# EAGLE design Cherry-MX-Testboard (EAGLE 9.3.2)
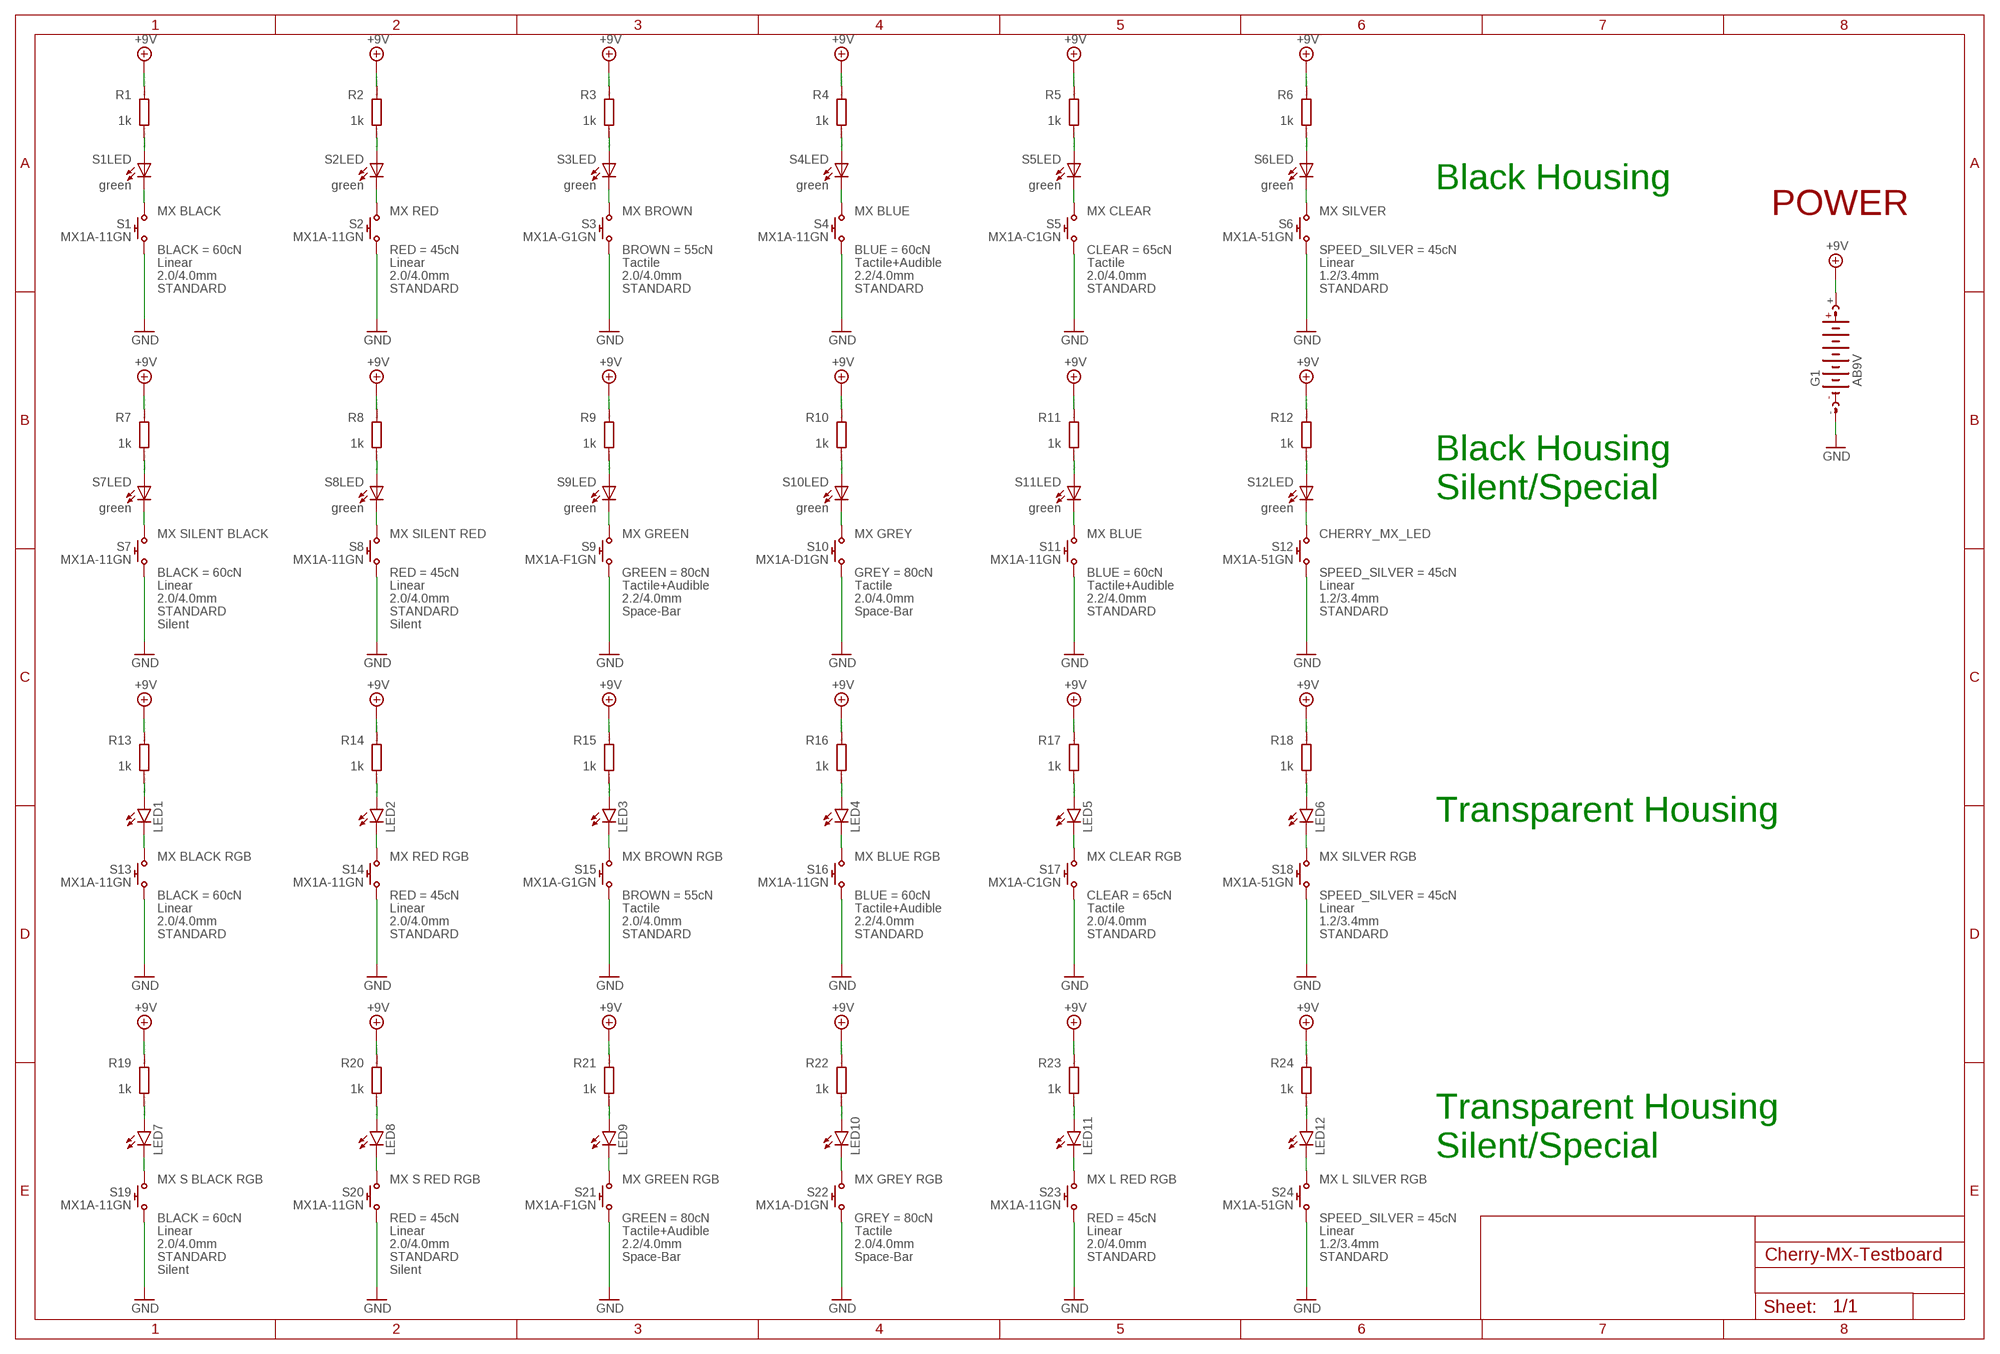
[diagram p0: schematic, sheet 1]

## Parts
G1  AB9V  [AB9V]
LED1  LEDMINI-TOP  [OSRAM-MINI-TOP-LED]
LED2  LEDMINI-TOP  [OSRAM-MINI-TOP-LED]
LED3  LEDMINI-TOP  [OSRAM-MINI-TOP-LED]
LED4  LEDMINI-TOP  [OSRAM-MINI-TOP-LED]
LED5  LEDMINI-TOP  [OSRAM-MINI-TOP-LED]
LED6  LEDMINI-TOP  [OSRAM-MINI-TOP-LED]
LED7  LEDMINI-TOP  [OSRAM-MINI-TOP-LED]
LED8  LEDMINI-TOP  [OSRAM-MINI-TOP-LED]
LED9  LEDMINI-TOP  [OSRAM-MINI-TOP-LED]
LED10  LEDMINI-TOP  [OSRAM-MINI-TOP-LED]
LED11  LEDMINI-TOP  [OSRAM-MINI-TOP-LED]
LED12  LEDMINI-TOP  [OSRAM-MINI-TOP-LED]
R1  1k  RR0402  [R0402]
R2  1k  RR0402  [R0402]
R3  1k  RR0402  [R0402]
R4  1k  RR0402  [R0402]
R5  1k  RR0402  [R0402]
R6  1k  RR0402  [R0402]
R7  1k  RR0402  [R0402]
R8  1k  RR0402  [R0402]
R9  1k  RR0402  [R0402]
R10  1k  RR0402  [R0402]
R11  1k  RR0402  [R0402]
R12  1k  RR0402  [R0402]
R13  1k  RR0402  [R0402]
R14  1k  RR0402  [R0402]
R15  1k  RR0402  [R0402]
R16  1k  RR0402  [R0402]
R17  1k  RR0402  [R0402]
R18  1k  RR0402  [R0402]
R19  1k  RR0402  [R0402]
R20  1k  RR0402  [R0402]
R21  1k  RR0402  [R0402]
R22  1k  RR0402  [R0402]
R23  1k  RR0402  [R0402]
R24  1k  RR0402  [R0402]
S1  MX BLACK  CHERRY_MX_LED  [CHERRY_MX_LED]
S2  MX RED  CHERRY_MX_LED  [CHERRY_MX_LED]
S3  MX BROWN  CHERRY_MX_LED  [CHERRY_MX_LED]
S4  MX BLUE  CHERRY_MX_LED  [CHERRY_MX_LED]
S5  MX CLEAR  CHERRY_MX_LED  [CHERRY_MX_LED]
S6  MX SILVER  CHERRY_MX_LED  [CHERRY_MX_LED]
S7  MX SILENT BLACK  CHERRY_MX_LED  [CHERRY_MX_LED]
S8  MX SILENT RED  CHERRY_MX_LED  [CHERRY_MX_LED]
S9  MX GREEN  CHERRY_MX_LED  [CHERRY_MX_LED]
S10  MX GREY  CHERRY_MX_LED  [CHERRY_MX_LED]
S11  MX BLUE  CHERRY_MX_LED  [CHERRY_MX_LED]
S12  CHERRY_MX_LED  [CHERRY_MX_LED]
S13  MX BLACK RGB  CHERRY_MX  [CHERRY_MX]
S14  MX RED RGB  CHERRY_MX  [CHERRY_MX]
S15  MX BROWN RGB  CHERRY_MX  [CHERRY_MX]
S16  MX BLUE RGB  CHERRY_MX  [CHERRY_MX]
S17  MX CLEAR RGB  CHERRY_MX  [CHERRY_MX]
S18  MX SILVER RGB  CHERRY_MX  [CHERRY_MX]
S19  MX S BLACK RGB  CHERRY_MX  [CHERRY_MX]
S20  MX S RED RGB  CHERRY_MX  [CHERRY_MX]
S21  MX GREEN RGB  CHERRY_MX  [CHERRY_MX]
S22  MX GREY RGB  CHERRY_MX  [CHERRY_MX]
S23  MX L RED RGB  CHERRY_MX  [CHERRY_MX]
S24  MX L SILVER RGB  CHERRY_MX  [CHERRY_MX]

## Nets
+9V [+9V]: G1.+ R1.1 R2.1 R3.1 R4.1 R5.1 R6.1 R7.1 R8.1 R9.1 R10.1 R11.1 R12.1 R13.1 R14.1 R15.1 R16.1 R17.1 R18.1 R19.1 R20.1 R21.1 R22.1 R23.1 R24.1
GND [GND]: G1.- S1.S1 S2.S1 S3.S1 S4.S1 S5.S1 S6.S1 S7.S1 S8.S1 S9.S1 S10.S1 S11.S1 S12.S1 S13.S1 S14.S1 S15.S1 S16.S1 S17.S1 S18.S1 S19.S1 S20.S1 S21.S1 S22.S1 S23.S1 S24.S1
N$1: S1.L2(C) S1.S2
N$2: S2.L2(C) S2.S2
N$3: R1.2 S1.L1(A)
N$4: R2.2 S2.L1(A)
N$5: S3.L2(C) S3.S2
N$6: R3.2 S3.L1(A)
N$7: S4.L2(C) S4.S2
N$8: R4.2 S4.L1(A)
N$9: S9.L2(C) S9.S2
N$10: R9.2 S9.L1(A)
N$11: S10.L2(C) S10.S2
N$12: R10.2 S10.L1(A)
N$13: S5.L2(C) S5.S2
N$14: R5.2 S5.L1(A)
N$15: S6.L2(C) S6.S2
N$16: R6.2 S6.L1(A)
N$17: S7.L2(C) S7.S2
N$18: R7.2 S7.L1(A)
N$19: S8.L2(C) S8.S2
N$20: R8.2 S8.L1(A)
N$21: LED1.C S13.S2
N$22: LED1.A R13.2
N$23: LED2.C S14.S2
N$24: LED2.A R14.2
N$25: LED3.C S15.S2
N$26: LED3.A R15.2
N$27: LED4.C S16.S2
N$28: LED4.A R16.2
N$29: LED9.C S21.S2
N$30: LED9.A R21.2
N$31: LED10.C S22.S2
N$32: LED10.A R22.2
N$33: LED5.C S17.S2
N$34: LED5.A R17.2
N$35: LED6.C S18.S2
N$36: LED6.A R18.2
N$37: LED7.C S19.S2
N$38: LED7.A R19.2
N$39: LED8.C S20.S2
N$40: LED8.A R20.2
N$41: LED11.C S23.S2
N$42: LED11.A R23.2
N$43: LED12.C S24.S2
N$44: LED12.A R24.2
N$45: S11.L2(C) S11.S2
N$46: R11.2 S11.L1(A)
N$47: S12.L2(C) S12.S2
N$48: R12.2 S12.L1(A)

## Notes on the sheet
- Black Housing
- POWER
- Black Housing
  Silent/Special
- Transparent Housing
- Transparent Housing
  Silent/Special

## Library data of the parts
G1 = battery:AB9V: 9-V BATTERY CLIP
LED1-LED12 = led:LED: LED OSRAM: - CHIPLED LG R971, LG N971, LY N971, LG Q971, LY Q971, LO R971, LY R971 LH N974, LH R974 LS Q976, LO Q976, LY Q976 LO Q996 - Hyper CHIPLED LW Q18S LB Q993, LB Q99A, LB R99A - SideLED LS A670, LO A670, LY A670, LG A670, LP A670 LB A673, LV A673, LT A673, LW A673 LH A674 LY A675 LS A676, LA A676, LO A676, LY A676, LW A676 LS A679, LY A679, LG A679 - Hyper Micro SIDELED® LS Y876, LA Y876, LO Y876, LY Y876 LT Y87S - SmartLED LW L88C, LW L88S LB L89C, LB L89S, LG L890 LS L89K, LO L89K, LY L89K LS L896, LA L896, LO L896, LY L896 - TOPLED LS T670, LO T670, LY T670, LG T670, LP T670 LSG T670, LSP T670, LSY T670, LOP T670, LYG T670 LG T671, LOG T671, LSG T671 LB T673, LV T673, LT T673, LW T673 LH T674 LS T676, LA T676, LO T676, LY T676, LB T676, LH T676, LSB T676, LW T676 LB T67C, LV T67C, LT T67C, LS T67K, LO T67K, LY T67K, LW E67C LS E67B, LA E67B, LO E67B, LY E67B, LB E67C, LV E67C, LT E67C LW T67C LS T679, LY T679, LG T679 LS T770, LO T770, LY T770, LG T770, LP T770 LB T773, LV T773, LT T773, LW T773 LH T774 LS E675, LA E675, LY E675, LS T675 LS T776, LA T776, LO T776, LY T776, LB T776 LHGB T686 LT T68C, LB T68C - Hyper Mini TOPLED® LB M676 - Mini TOPLED Santana® LG M470 LS M47K, LO M47K, LY M47K Source: http://www.osram.convergy.de LUXEON: - LUMILED® LXK2-PW12-R00, LXK2-PW12-S00, LXK2-PW14-U00, LXK2-PW14-V00 LXK2-PM12-R00, LXK2-PM12-S00, LXK2-PM14-U00 LXK2-PE12-Q00, LXK2-PE12-R00, LXK2-PE12-S00, LXK2-PE14-T00, LXK2-PE14-U00 LXK2-PB12-K00, LXK2-PB12-L00, LXK2-PB12-M00, LXK2-PB14-N00, LXK2-PB14-P00, LXK2-PB14-Q00 LXK2-PR12-L00, LXK2-PR12-M00, LXK2-PR14-Q00, LXK2-PR14-R00 LXK2-PD12-Q00, LXK2-PD12-R00, LXK2-PD12-S00 LXK2-PH12-R00, LXK2-PH12-S00 LXK2-PL12-P00, LXK2-PL12-Q00, LXK2-PL12-R00 Source: www.luxeon.com KINGBRIGHT: KA-3528ASYC Source: www.kingbright.com
R1-R24 = eagle-ltspice:R: RESISTOR, European symbol; SPICEMODEL: NONE; SPICEPREFIX: R
S1 = cherry:CHERRY_MX_LED: Cherry MX with LED; BLACK: 60cN; CHARACTERISTICS: Linear; CODE: MX1A-11GN; COLOR: green; FARNELL: 2292961; FEATURE: STANDARD; MOUSER: 540_MX1A_11NW; TRAVEL: 2.0/4.0mm
S2 = cherry:CHERRY_MX_LED: Cherry MX with LED; CHARACTERISTICS: Linear; CODE: MX1A-11GN; COLOR: green; FARNELL: 2292961; FEATURE: STANDARD; MOUSER: 540_MX1A_11NW; RED: 45cN; TRAVEL: 2.0/4.0mm
S3 = cherry:CHERRY_MX_LED: Cherry MX with LED; BROWN: 55cN; CHARACTERISTICS: Tactile; CODE: MX1A-G1GN; COLOR: green; FARNELL: 2292961; FEATURE: STANDARD; MOUSER: 540_MX1A_11NW; TRAVEL: 2.0/4.0mm
S4 S11 = cherry:CHERRY_MX_LED: Cherry MX with LED; BLUE: 60cN; CHARACTERISTICS: Tactile+Audible; CODE: MX1A-11GN; COLOR: green; FARNELL: 2292961; FEATURE: STANDARD; MOUSER: 540_MX1A_E1NW; TRAVEL: 2.2/4.0mm
S5 = cherry:CHERRY_MX_LED: Cherry MX with LED; CHARACTERISTICS: Tactile; CLEAR: 65cN; CODE: MX1A-C1GN; COLOR: green; FARNELL: 2292961; FEATURE: STANDARD; MOUSER: 540_MX1A_11NW; TRAVEL: 2.0/4.0mm
S6 S12 = cherry:CHERRY_MX_LED: Cherry MX with LED; CHARACTERISTICS: Linear; CODE: MX1A-51GN; COLOR: green; FARNELL: 2292961; FEATURE: STANDARD; MOUSER: 540_MX1A_11NW; SPEED_SILVER: 45cN; TRAVEL: 1.2/3.4mm
S7 = cherry:CHERRY_MX_LED: Cherry MX with LED; BLACK: 60cN; CHARACTERISTICS: Linear; CODE: MX1A-11GN; COLOR: green; FARNELL: 2292961; FEATURE: STANDARD; MOUSER: 540_MX1A_11NW; NOISE: Silent; TRAVEL: 2.0/4.0mm
S8 = cherry:CHERRY_MX_LED: Cherry MX with LED; CHARACTERISTICS: Linear; CODE: MX1A-11GN; COLOR: green; FARNELL: 2292961; FEATURE: STANDARD; MOUSER: 540_MX1A_11NW; NOISE: Silent; RED: 45cN; TRAVEL: 2.0/4.0mm
S9 = cherry:CHERRY_MX_LED: Cherry MX with LED; CHARACTERISTICS: Tactile+Audible; CODE: MX1A-F1GN; COLOR: green; FARNELL: 2292961; FEATURE: Space-Bar; GREEN: 80cN; MOUSER: 540_MX1A_11NW; TRAVEL: 2.2/4.0mm
S10 = cherry:CHERRY_MX_LED: Cherry MX with LED; CHARACTERISTICS: Tactile; CODE: MX1A-D1GN; COLOR: green; FARNELL: 2292961; FEATURE: Space-Bar; GREY: 80cN; MOUSER: 540_MX1A_21NW; TRAVEL: 2.0/4.0mm
S13 = cherry:CHERRY_MX: Cherry keymodule MX; BLACK: 60cN; CHARACTERISTICS: Linear; CODE: MX1A-11GN; COLOR: green; FARNELL: 2292961; FEATURE: STANDARD; MOUSER: 540-MX1A-11NW; TRAVEL: 2.0/4.0mm
S14 S23 = cherry:CHERRY_MX: Cherry keymodule MX; CHARACTERISTICS: Linear; CODE: MX1A-11GN; COLOR: green; FARNELL: 2292961; FEATURE: STANDARD; MOUSER: 540-MX1A-11NW; RED: 45cN; TRAVEL: 2.0/4.0mm
S15 = cherry:CHERRY_MX: Cherry keymodule MX; BROWN: 55cN; CHARACTERISTICS: Tactile; CODE: MX1A-G1GN; COLOR: green; FARNELL: 2292961; FEATURE: STANDARD; MOUSER: 540-MX1A-11NW; TRAVEL: 2.0/4.0mm
S16 = cherry:CHERRY_MX: Cherry keymodule MX; BLUE: 60cN; CHARACTERISTICS: Tactile+Audible; CODE: MX1A-11GN; COLOR: green; FARNELL: 2292961; FEATURE: STANDARD; MOUSER: 540-MX1A-11NW; TRAVEL: 2.2/4.0mm
S17 = cherry:CHERRY_MX: Cherry keymodule MX; CHARACTERISTICS: Tactile; CLEAR: 65cN; CODE: MX1A-C1GN; COLOR: green; FARNELL: 2292961; FEATURE: STANDARD; MOUSER: 540-MX1A-11NW; TRAVEL: 2.0/4.0mm
S18 S24 = cherry:CHERRY_MX: Cherry keymodule MX; CHARACTERISTICS: Linear; CODE: MX1A-51GN; COLOR: green; FARNELL: 2292961; FEATURE: STANDARD; MOUSER: 540-MX1A-11NW; SPEED_SILVER: 45cN; TRAVEL: 1.2/3.4mm
S19 = cherry:CHERRY_MX: Cherry keymodule MX; BLACK: 60cN; CHARACTERISTICS: Linear; CODE: MX1A-11GN; COLOR: green; FARNELL: 2292961; FEATURE: STANDARD; MOUSER: 540-MX1A-11NW; NOISE: Silent; TRAVEL: 2.0/4.0mm
S20 = cherry:CHERRY_MX: Cherry keymodule MX; CHARACTERISTICS: Linear; CODE: MX1A-11GN; COLOR: green; FARNELL: 2292961; FEATURE: STANDARD; MOUSER: 540-MX1A-11NW; NOISE: Silent; RED: 45cN; TRAVEL: 2.0/4.0mm
S21 = cherry:CHERRY_MX: Cherry keymodule MX; CHARACTERISTICS: Tactile+Audible; CODE: MX1A-F1GN; COLOR: green; FARNELL: 2292961; FEATURE: Space-Bar; GREEN: 80cN; MOUSER: 540-MX1A-11NW; TRAVEL: 2.2/4.0mm
S22 = cherry:CHERRY_MX: Cherry keymodule MX; CHARACTERISTICS: Tactile; CODE: MX1A-D1GN; COLOR: green; FARNELL: 2292961; FEATURE: Space-Bar; GREY: 80cN; MOUSER: 540-MX1A-11NW; TRAVEL: 2.0/4.0mm

## Net classes
1 GND: width 0.61 mm, drill 0.254 mm, clearance 1.016 mm
2 +9V: width 0.61 mm, drill 0.254 mm, clearance 1.016 mm

## Board
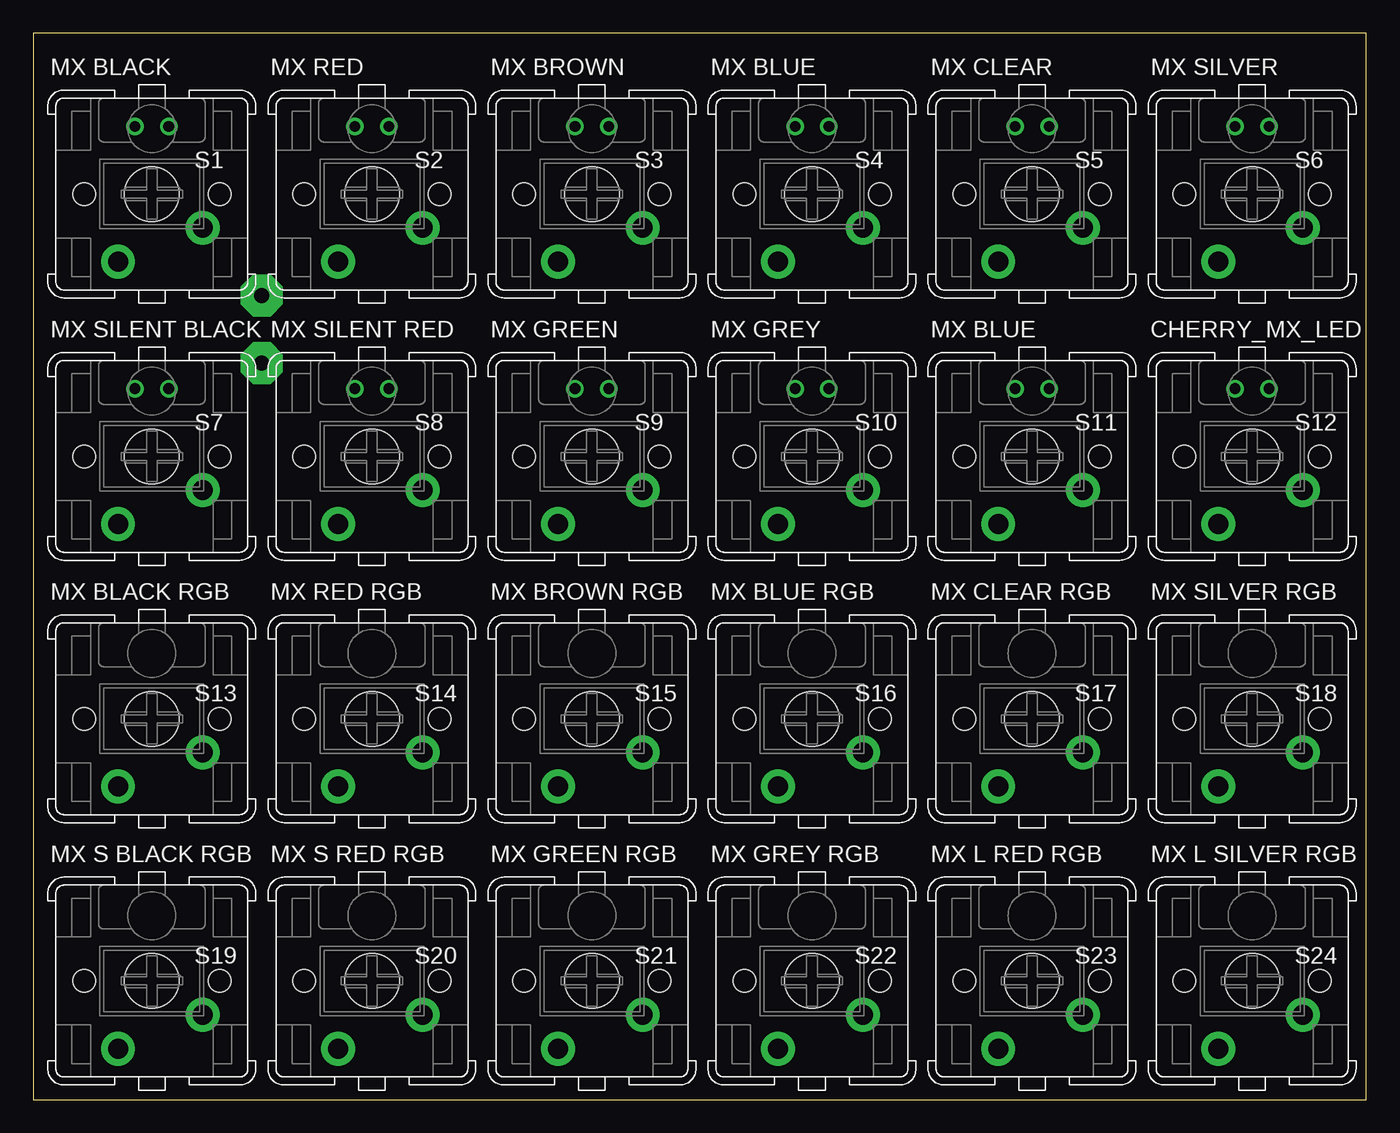
[diagram p1: board, top side]
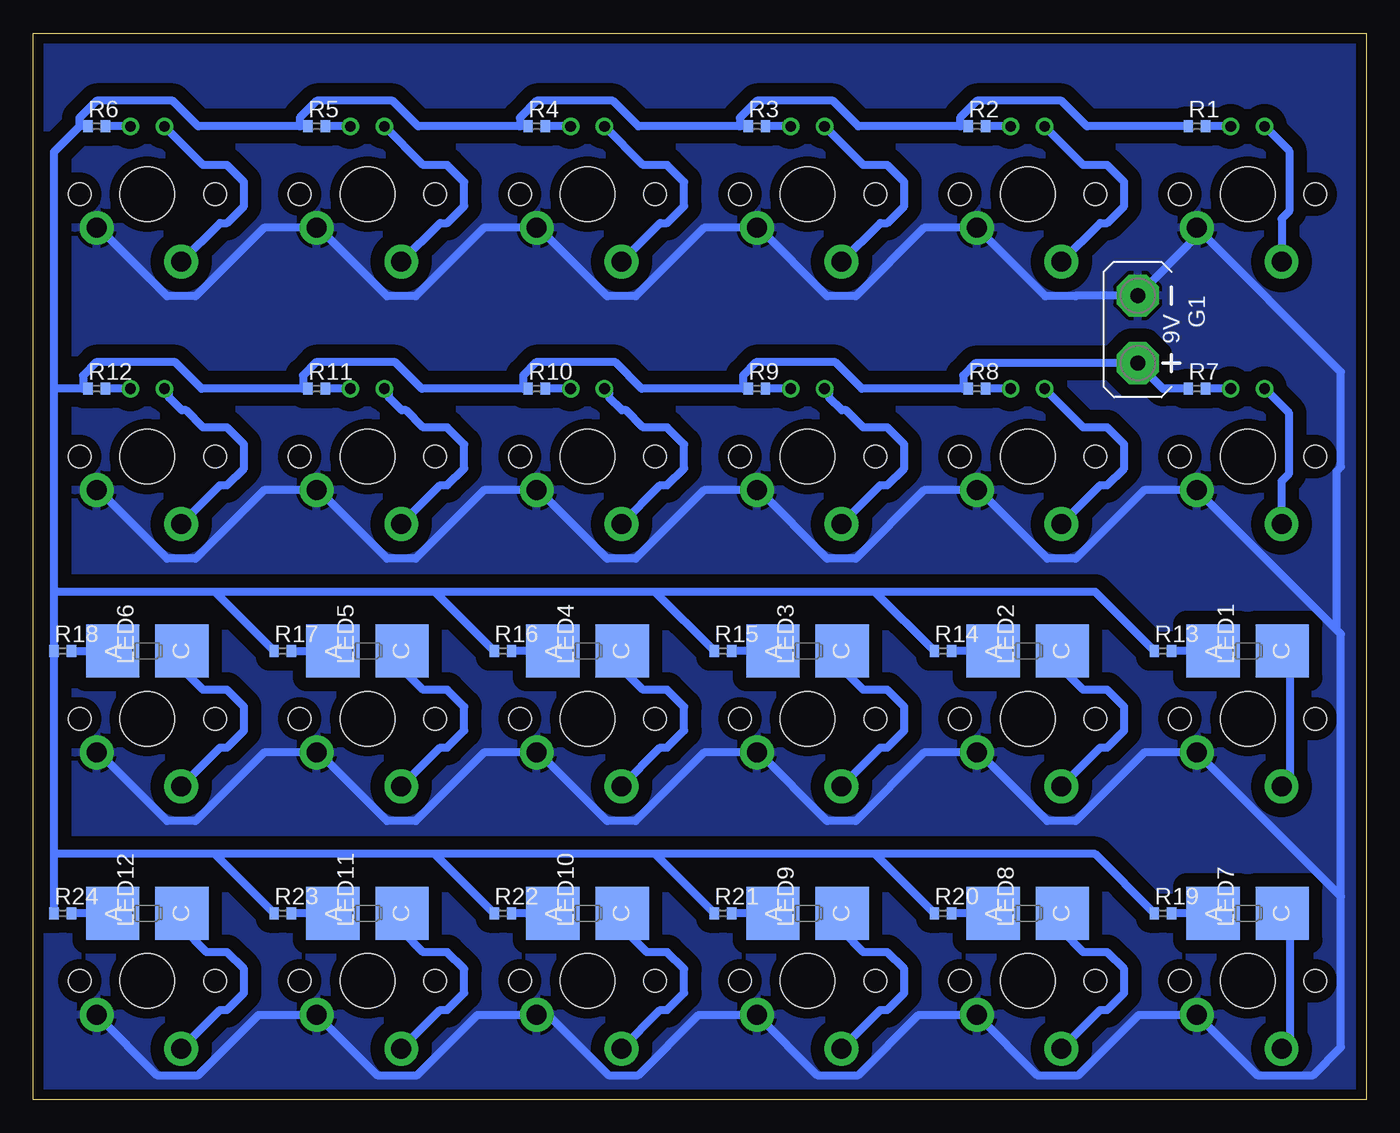
[diagram p2: board, bottom side, seen from below]

Size 100 x 80 mm. Coordinates in mm from the lower left corner, seen from the top.
Outline: 0,0 100,0 100,80 0,80 0,0
Copper layers (1*16): Top 0.035mm / dielectric 1.5mm / Bottom 0.035mm
Design rules "default *": minimum track width 6mil, minimum drill 0.35mm, track to track 10mil, track to pad 10mil, pad to pad 10mil, via to via 10mil, smd to smd 10mil, copper to edge 30mil, drill to drill 6mil, minimum pad ring 10mil, minimum via ring 8mil, stop-mask expansion 4mil, vias tented up to drill 0mil, thermal gap 10mil

### Footprints (pad centres in the part's own frame; a part is rotated, then mirrored left to right if it is on the bottom)
AB9V = drill 1.118 pad 3.15 octagon: + 0,2.54; - 0,-2.54
OSRAM-MINI-TOP-LED = smd 4 x 4: A 0,2.6; C 0,-2.6
R0402 = smd 0.7 x 0.9: 1 -0.65,0; 2 0.65,0
CHERRY_MX_LED = drill 0.8: L1 -1.27,-5.08; L2 1.27,-5.08 | drill 1.5 pad 2.54: S1 -3.81,2.54; S2 2.54,5.08 | hole 1.7: -5.08,0; 5.08,0 | hole 4.1: 0,0
CHERRY_MX = drill 1.5 pad 2.54: S1 -3.81,2.54; S2 2.54,5.08 | hole 1.7: -5.08,0; 5.08,0 | hole 4.1: 0,0

### Placement (x,y rotation side)
G1  17.14,57.78 180 bottom
LED1  8.89,33.66 90 bottom
LED2  25.4,33.66 90 bottom
LED3  41.91,33.66 90 bottom
LED4  58.42,33.66 90 bottom
LED5  74.93,33.66 90 bottom
LED6  91.44,33.66 90 bottom
LED7  8.89,13.97 90 bottom
LED8  25.4,13.97 90 bottom
LED9  41.91,13.97 90 bottom
LED10  58.42,13.97 90 bottom
LED11  74.93,13.97 90 bottom
LED12  91.44,13.97 90 bottom
R1  12.7,73.03 0 bottom
R2  29.21,73.03 0 bottom
R3  45.72,73.03 0 bottom
R4  62.23,73.03 0 bottom
R5  78.74,73.03 0 bottom
R6  95.25,73.03 0 bottom
R7  12.7,53.34 0 bottom
R8  29.21,53.34 0 bottom
R9  45.72,53.34 0 bottom
R10  62.23,53.34 0 bottom
R11  78.74,53.34 0 bottom
R12  95.25,53.34 0 bottom
R13  15.24,33.66 0 bottom
R14  31.75,33.66 0 bottom
R15  48.26,33.66 0 bottom
R16  64.77,33.66 0 bottom
R17  81.28,33.66 0 bottom
R18  97.79,33.66 0 bottom
R19  15.24,13.97 0 bottom
R20  31.75,13.97 0 bottom
R21  48.26,13.97 0 bottom
R22  64.77,13.97 0 bottom
R23  81.28,13.97 0 bottom
R24  97.79,13.97 0 bottom
S1  8.89,67.94 180 top
S2  25.4,67.94 180 top
S3  41.91,67.94 180 top
S4  58.42,67.94 180 top
S5  74.93,67.94 180 top
S6  91.44,67.94 180 top
S7  8.89,48.26 180 top
S8  25.4,48.26 180 top
S9  41.91,48.26 180 top
S10  58.42,48.26 180 top
S11  74.93,48.26 180 top
S12  91.44,48.26 180 top
S13  8.89,28.57 180 top
S14  25.4,28.57 180 top
S15  41.91,28.57 180 top
S16  58.42,28.57 180 top
S17  74.93,28.57 180 top
S18  91.44,28.57 180 top
S19  8.89,8.89 180 top
S20  25.4,8.89 180 top
S21  41.91,8.89 180 top
S22  58.42,8.89 180 top
S23  74.93,8.89 180 top
S24  91.44,8.89 180 top

### Tracks (layer width: path | path; a pad name or v marks a point on that pad's centre or on a via)
+9V
  Bottom 0.61: R12.1 96.27,53.34 | 96.27,53.34 98.42,53.34 | 98.42,53.34 98.44,53.35 98.44,71.11 96.52,73.03 | 98.42,53.34 98.44,53.33 98.44,38.1 | R18.1 98.44,23.6 98.44,18.41 | R18.1 98.44,38.1 | R18.1 | R17.1 86.38,38.1 | 86.38,38.1 98.44,38.1 | R16.1 69.86,38.1 | 69.86,38.1 86.38,38.1 | R21.1 53.35,18.41 | R24.1 98.44,18.41 | 53.35,18.41 69.85,18.41 | 69.85,18.41 86.36,18.41 | 86.36,18.41 98.44,18.41 | R20.1 36.84,18.41 | 36.84,18.41 53.35,18.41 | R19.1 20.34,18.41 36.84,18.41 | R15.1 53.35,38.1 | 53.35,38.1 69.86,38.1 | R14.1 36.84,38.1 | 36.84,38.1 53.35,38.1 | R13.1 20.34,38.1 36.84,38.1 | R22.1 69.85,18.4 69.85,18.41 | R23.1 86.36,18.4 86.36,18.41 | 30.23,53.34 30.23,54.34 29.32,55.24 G1.+ 15.24,53.34 R7.1 | 46.74,53.34 46.74,54.34 45.76,55.31 39.82,55.31 37.85,53.34 30.23,53.34 | 63.25,53.34 63.25,54.34 62.27,55.31 56.33,55.31 54.36,53.34 46.74,53.34 | 79.76,53.34 79.76,54.34 78.78,55.31 72.84,55.31 70.87,53.34 63.25,53.34 | 96.27,53.34 96.27,54.34 95.29,55.31 89.35,55.31 87.38,53.34 79.76,53.34 | R11.1 79.76,53.34 | R10.1 63.25,53.34 | R9.1 46.74,53.34 | R8.1 30.23,53.34 | R1.1 20.95,73.03 22.86,74.93 29.21,74.93 30.48,73.66 30.48,73.03 | R2.1 30.48,73.03 | 30.48,73.03 38.1,73.03 40.01,74.93 45.72,74.93 46.99,73.66 46.99,73.03 | 46.99,73.03 54.61,73.03 56.52,74.93 62.23,74.93 63.5,73.66 63.5,73.03 | 96.52,73.03 96.52,73.66 95.25,74.93 89.53,74.93 87.63,73.03 80.01,73.03 | R5.1 80.01,73.03 | R6.1 96.52,73.03 | R3.1 46.99,73.03 | R4.1 63.5,73.03 | 63.5,73.03 71.12,73.03 73.03,74.93 78.74,74.93 80.01,73.66 80.01,73.03
GND
  Bottom 0.61: 1.89,15.23 S13.S1 16.66,26.04 21.79,20.9 23.93,20.9 29.06,26.04 S14.S1 33.17,26.04 38.3,20.9 40.44,20.9 45.57,26.04 S15.S1 49.68,26.04 54.81,20.9 56.95,20.9 62.08,26.04 S16.S1 66.19,26.04 71.32,20.9 73.46,20.9 78.59,26.04 S17.S1 82.7,26.04 87.83,20.9 89.97,20.9 95.1,26.04 S18.S1 | 1.89,15.23 1.89,3.92 3.98,1.83 8.18,1.83 S19.S1 17.07,6.35 21.59,1.83 24.69,1.83 S20.S1 33.58,6.35 38.1,1.83 41.2,1.83 S21.S1 50.09,6.35 54.61,1.83 56.84,1.83 61.37,6.35 S22.S1 66.67,6.35 71.2,1.83 74.22,1.83 S23.S1 83.11,6.35 87.63,1.83 90.73,1.83 S24.S1 | 1.89,15.23 1.89,34.91 2.22,35.24 | 2.22,35.24 S7.S1 16.66,45.72 21.79,40.59 23.93,40.59 29.06,45.72 S8.S1 33.17,45.72 38.3,40.59 40.44,40.59 45.57,45.72 S9.S1 49.68,45.72 54.81,40.59 56.95,40.59 62.08,45.72 S10.S1 66.19,45.72 71.32,40.59 73.46,40.59 78.59,45.72 S11.S1 82.7,45.72 87.83,40.59 89.97,40.59 95.1,45.72 S12.S1 | 2.22,35.24 2.22,47.14 1.89,47.47 1.89,54.6 S1.S1 12.7,64.77 G1.- 21.74,60.33 21.79,60.27 24.08,60.27 S2.S1 33.17,65.41 38.3,60.27 40.44,60.27 45.57,65.41 S3.S1 49.68,65.41 54.81,60.27 56.95,60.27 62.08,65.41 S4.S1 66.19,65.41 71.32,60.27 73.46,60.27 78.59,65.41 S5.S1 82.7,65.41 87.83,60.27 89.97,60.27 95.1,65.41 S6.S1
  pour Bottom: -0.64,80.64 -0.64,-0.64 100.97,-0.64 100.97,80.64
N$1
  Bottom 0.61: S1.S2 6.35,66.08 5.77,66.65 5.77,71.18 S1.L2
N$2
  Bottom 0.61: S2.S2 19.95,65.77 19.42,65.77 18.15,67.05 18.15,68.84 19.42,70.12 21.22,70.12 S2.L2
N$3
  Bottom 0.61: S1.L1 R1.2
N$4
  Bottom 0.61: S2.L1 R2.2
N$5
  Bottom 0.61: S3.S2 36.46,65.77 35.93,65.77 34.66,67.05 34.66,68.84 35.93,70.12 37.73,70.12 S3.L2
N$6
  Bottom 0.61: S3.L1 R3.2
N$7
  Bottom 0.61: S4.S2 52.97,65.77 52.44,65.77 51.17,67.05 51.17,68.84 52.44,70.12 54.24,70.12 S4.L2
N$8
  Bottom 0.61: S4.L1 R4.2
N$9
  Bottom 0.61: S9.S2 36.46,46.09 35.93,46.09 34.66,47.36 34.66,49.16 35.93,50.43 37.73,50.43 39.01,51.71 39.34,51.71 40.29,52.67 40.29,52.99 S9.L2
N$10
  Bottom 0.61: S9.L1 R9.2
N$11
  Bottom 0.61: S10.S2 52.97,46.09 52.44,46.09 51.17,47.36 51.17,49.16 52.44,50.43 54.24,50.43 55.52,51.71 55.85,51.71 56.8,52.67 56.8,52.99 S10.L2
N$12
  Bottom 0.61: S10.L1 R10.2
N$13
  Bottom 0.61: S5.S2 69.48,65.77 68.95,65.77 67.68,67.05 67.68,68.84 68.95,70.12 70.75,70.12 S5.L2
N$14
  Bottom 0.61: S5.L1 R5.2
N$15
  Bottom 0.61: S6.S2 85.99,65.77 85.46,65.77 84.19,67.05 84.19,68.84 85.46,70.12 87.26,70.12 S6.L2
N$16
  Bottom 0.61: S6.L1 R6.2
N$17
  Bottom 0.61: S7.S2 6.35,46.39 5.77,46.97 5.77,51.49 S7.L2
N$18
  Bottom 0.61: S7.L1 R7.2
N$19
  Bottom 0.61: S8.S2 19.95,46.09 19.42,46.09 18.15,47.36 18.15,49.16 19.42,50.43 21.22,50.43 S8.L2
N$20
  Bottom 0.61: S8.L1 R8.2
N$21
  Bottom 0.61: LED1.C 5.71,33.08 5.71,24.13 S13.S2
N$22
  Bottom 0.61: LED1.A R13.2
N$23
  Bottom 0.61: S14.S2 19.95,26.4 19.42,26.4 18.15,27.68 18.15,29.47 19.42,30.75 21.22,30.75 22.8,32.33 LED2.C
N$24
  Bottom 0.61: LED2.A R14.2
N$25
  Bottom 0.61: S15.S2 36.46,26.4 35.93,26.4 34.66,27.68 34.66,29.47 35.93,30.75 37.73,30.75 39.31,32.33 LED3.C
N$26
  Bottom 0.61: LED3.A R15.2
N$27
  Bottom 0.61: S16.S2 52.97,26.4 52.44,26.4 51.17,27.68 51.17,29.47 52.44,30.75 54.24,30.75 55.82,32.33 LED4.C
N$28
  Bottom 0.61: LED4.A R16.2
N$29
  Bottom 0.61: S21.S2 36.46,6.72 35.93,6.72 34.66,7.99 34.66,9.79 35.93,11.06 37.73,11.06 39.31,12.64 LED9.C
N$30
  Bottom 0.61: LED9.A R21.2
N$31
  Bottom 0.61: S22.S2 52.97,6.72 52.44,6.72 51.17,7.99 51.17,9.79 52.44,11.06 53.98,11.06 55.82,12.91 LED10.C
N$32
  Bottom 0.61: LED10.A 61.8,13.97 62.07,13.7 62.7,13.7 62.97,13.97 R22.2
N$33
  Bottom 0.61: S17.S2 69.48,26.4 68.95,26.4 67.68,27.68 67.68,29.47 68.95,30.75 70.75,30.75 72.33,32.33 LED5.C
N$34
  Bottom 0.61: R17.2 LED5.A
N$35
  Bottom 0.61: S18.S2 85.99,26.4 85.46,26.4 84.19,27.68 84.19,29.47 85.46,30.75 87.26,30.75 88.84,32.33 LED6.C
N$36
  Bottom 0.61: R18.2 LED6.A
N$37
  Bottom 0.61: LED7.C 6.29,12.64 5.71,12.06 5.71,4.45 S19.S2
N$38
  Bottom 0.61: LED7.A R19.2
N$39
  Bottom 0.61: S20.S2 19.95,6.72 19.42,6.72 18.15,7.99 18.15,9.79 19.42,11.06 21.22,11.06 22.8,12.64 LED8.C
N$40
  Bottom 0.61: LED8.A R20.2
N$41
  Bottom 0.61: S23.S2 69.48,6.72 68.95,6.72 67.68,7.99 67.68,9.79 68.95,11.06 70.75,11.06 72.33,12.64 LED11.C
N$42
  Bottom 0.61: LED11.A R23.2
N$43
  Bottom 0.61: S24.S2 85.99,6.72 85.46,6.72 84.19,7.99 84.19,9.79 85.46,11.06 87,11.06 88.84,12.91 LED12.C
N$44
  Bottom 0.61: LED12.A R24.2
N$45
  Bottom 0.61: S11.S2 69.48,46.09 68.95,46.09 67.68,47.36 67.68,49.16 68.95,50.43 70.75,50.43 72.03,51.71 72.36,51.71 73.31,52.67 73.31,52.99 S11.L2
N$46
  Bottom 0.61: S11.L1 R11.2
N$47
  Bottom 0.61: S12.S2 85.99,46.09 85.46,46.09 84.19,47.36 84.19,49.16 85.46,50.43 87.26,50.43 88.54,51.71 88.87,51.71 89.82,52.67 89.82,52.99 S12.L2
N$48
  Bottom 0.61: S12.L1 R12.2